# Altium schematic sheet Pyros.SchDoc
size A; SheetNumber: 6; SheetTotal: 7
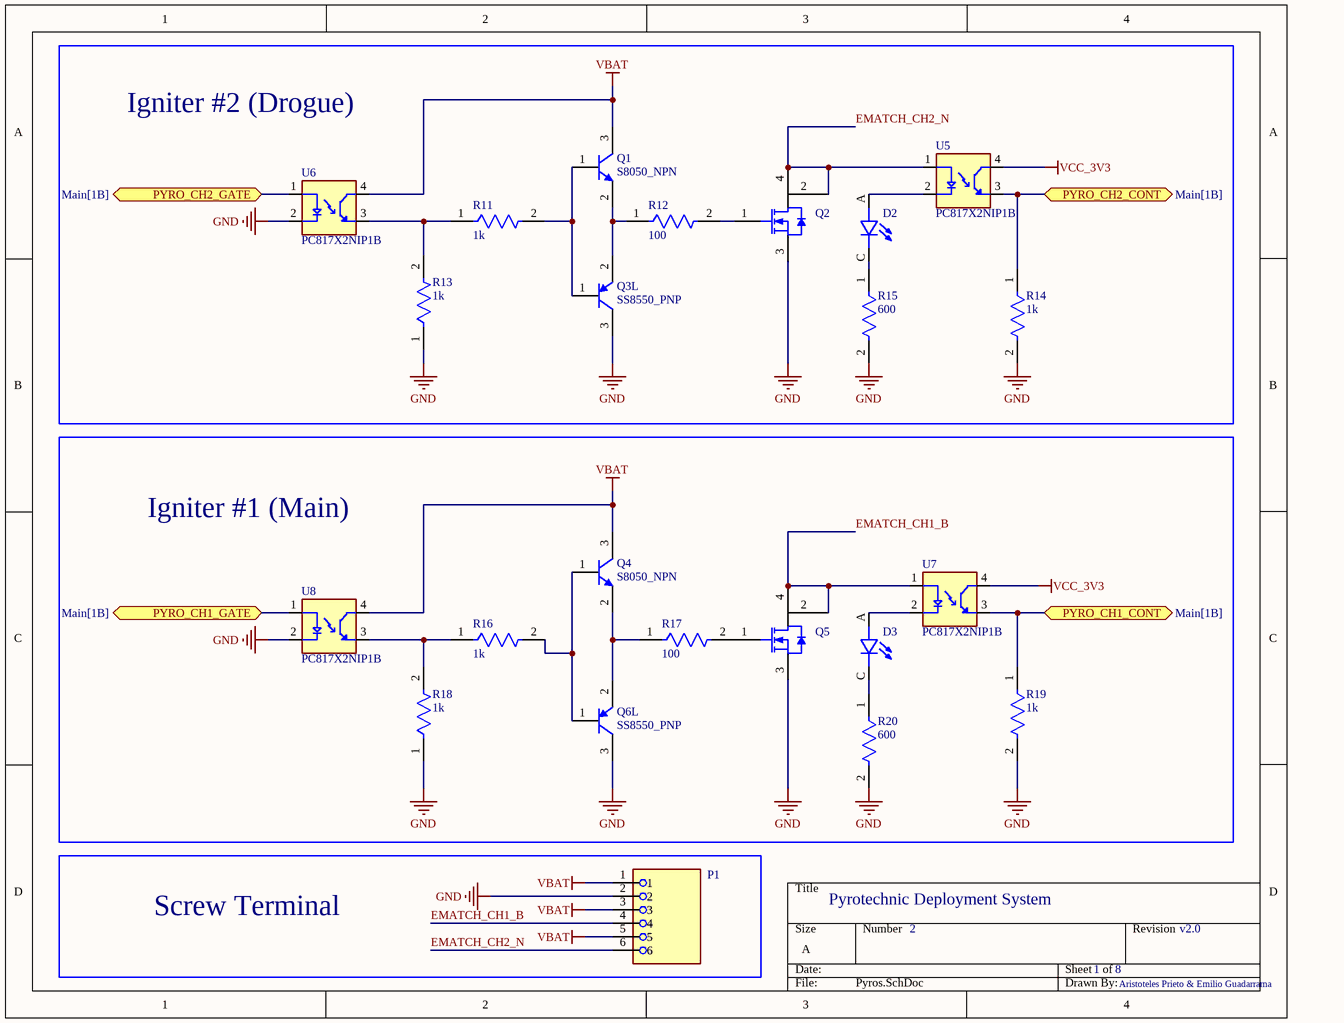
[diagram p0: Pyros.SchDoc]

## Parts
D2  SML-LXT0805IW-TR  [LEDC2012X120N]  (value not drawn)
D3  SML-LXT0805IW-TR  [LEDC2012X120N]  (value not drawn)
P1  1729160  [PHOENIX_1729160]  (value not drawn)
Q1  S8050_NPN  [PCBComponent_1]
Q2  NCE6005AR_Mosfet_N  [PCBComponent_1]  (value not drawn)
Q3  SS8550_PNP  [PCBComponent_1]  (part L of 12)
Q4  S8050_NPN  [PCBComponent_1]
Q5  NCE6005AR_Mosfet_N  [PCBComponent_1]  (value not drawn)
Q6  SS8550_PNP  [PCBComponent_1]  (part L of 12)
R11  1k  [FP-MCT0603-IPC_A]
R12  100  [FP-MCT0603-IPC_A]
R13  1k  [FP-MCT0603-IPC_A]
R14  1k  [FP-MCT0603-IPC_A]
R15  600  [FP-MCT0603-IPC_A]
R16  1k  [FP-MCT0603-IPC_A]
R17  100  [FP-MCT0603-IPC_A]
R18  1k  [FP-MCT0603-IPC_A]
R19  1k  [FP-MCT0603-IPC_A]
R20  600  [FP-MCT0603-IPC_A]
U5  PC817X2NIP1B  [SOIC254P960X420-4N]
U6  PC817X2NIP1B  [SOIC254P960X420-4N]
U7  PC817X2NIP1B  [SOIC254P960X420-4N]
U8  PC817X2NIP1B  [SOIC254P960X420-4N]

## Blocks framed on the sheet
Igniter #2 (Drogue): D2 Q1-Q3 R11-R15 U5 U6
Igniter #1 (Main): D3 Q4-Q6 R16-R20 U7 U8
Screw Terminal: P1

## Ports
PYRO_CH1_CONT (bidir, see Main[1B]), PYRO_CH1_GATE (bidir, see Main[1B]), PYRO_CH2_CONT (bidir, see Main[1B]), PYRO_CH2_GATE (bidir, see Main[1B])

## Nets
GND: P1.2 Q2.3(S) Q3.3(C) Q5.3(S) Q6.3(C) R13.1 R14.2 R15.2 R18.1 R19.2 R20.2 U6.2(C) U8.2(C)
VBAT: P1.1 P1.3 P1.5 Q1.3(C) Q4.3(C) U6.4(CT) U8.4(CT)
VCC_3V3: U5.4(CT) U7.4(CT)
EMATCH_CH1_B: P1.4 Q5.2(D) Q5.4(D) U7.1(A)
EMATCH_CH2_N: P1.6 Q2.2(D) Q2.4(D) U5.1(A)
PYRO_CH1_CONT: R19.1 U7.3(ET) ; port PYRO_CH1_CONT
PYRO_CH1_GATE: U8.1(A) ; port PYRO_CH1_GATE
PYRO_CH2_CONT: R14.1 U5.3(ET) ; port PYRO_CH2_CONT
PYRO_CH2_GATE: U6.1(A) ; port PYRO_CH2_GATE
NetD2_A: D2.A U5.2(C)
NetD2_C: D2.C R15.1
NetD3_A: D3.A U7.2(C)
NetD3_C: D3.C R20.1
NetQ1_1: Q1.1(B) Q3.1(B) R11.2
NetQ1_2: Q1.2(E) Q3.2(E) R12.1
NetQ2_1: Q2.1(G) R12.2
NetQ4_1: Q4.1(B) Q6.1(B) R16.2
NetQ4_2: Q4.2(E) Q6.2(E) R17.1
NetQ5_1: Q5.1(G) R17.2
NetR11_1: R11.1 R13.2 U6.3(ET)
NetR16_1: R16.1 R18.2 U8.3(ET)

## Notes on the sheet
- Pyrotechnic Deployment System
- 2
- 1
- 8
- v2.0
- Aristoteles Prieto & Emilio Guadarrama

## Library data of the parts
D2 D3 = SML-LXT0805IW-TR: LED;Red;11mcd;0.061In.Dia.;SMD;100mA;2V Vf;635nm;140deg;SMD;White Diffused;5V Vr | Lumex SML-LXT0805IW-TR; MF: Lumex Opto/Components; SnapEDA_Link: https://www.snapeda.com/parts/SML-LXT0805IW-TR/Lumex+Opto%252FComponents+Inc./view-part/?ref=snap; Package: 0805 Lumex; Value: *; MP: SML-LXT0805IW-TR; Check_prices: https://www.snapeda.com/parts/SML-LXT0805IW-TR/Lumex+Opto%252FComponents+Inc./view-part/?ref=eda
P1 = 1729160: PCB Terminal Screw 5.08mm 16AWG 400V 13.5A 6 Position COMBICON MKDSN Series | Phoenix Contact 1729160; SnapEDA_Link: https://www.snapeda.com/parts/1729160/Phoenix+Contact/view-part/?ref=snap; Package: None; Value: *; MF: Phoenix Contact; MP: 1729160; Check_prices: https://www.snapeda.com/parts/1729160/Phoenix+Contact/view-part/?ref=eda
Q1 Q3 Q4 Q6 = Component_1
Q2 Q5 = NCE6005AR
R11-R20 = CMP-02407-011165-1: RES SMD 100 OHM 1% 1/8W 0603; Temperature Coefficient: 25ppm/°C; Resistance: 20kR; Power Rating: 125mW; Tolerance: 0.1%; Voltage Rating: 75V; Length: 1.55mm; Case Code (Imperial): 0603; Case/Package: 0603; Construction: Rectangular; Package Quantity: 1000; Number of Terminations: 2; Termination: SMD/SMT; Resistor Type: Thin Film; Features: Automotive AEC-Q200; Series: MCT 0603 - Precision; Max Operating Temperature: 155°C; Depth: 0.85mm; Max Power Dissipation: 125mW; Min Operating Temperature: -55°C; Width: 0.033inch; Case Code (Metric): 1608; Packaging: Tape and Reel; Weight: 6.7E-05oz; Military Standard: Not; Height: 0.022inch
U5-U8 = PC817X2NIP1B: Optocoupler DC-IN 1-CH Transistor DC-OUT 4-Pin DIP SMD T/R; MF: Sharp Microelectronics; SnapEDA_Link: https://www.snapeda.com/parts/PC817X2NIP1B/Sharp+Microelectronics/view-part/?ref=snap; Package: SMD-4 Sharp Microelectronics; Value: *; MP: PC817X2NIP1B; Check_prices: https://www.snapeda.com/parts/PC817X2NIP1B/Sharp+Microelectronics/view-part/?ref=eda